# Altium schematic sheet AVR Board 4.0 FTDI Ports.SchDoc
size A
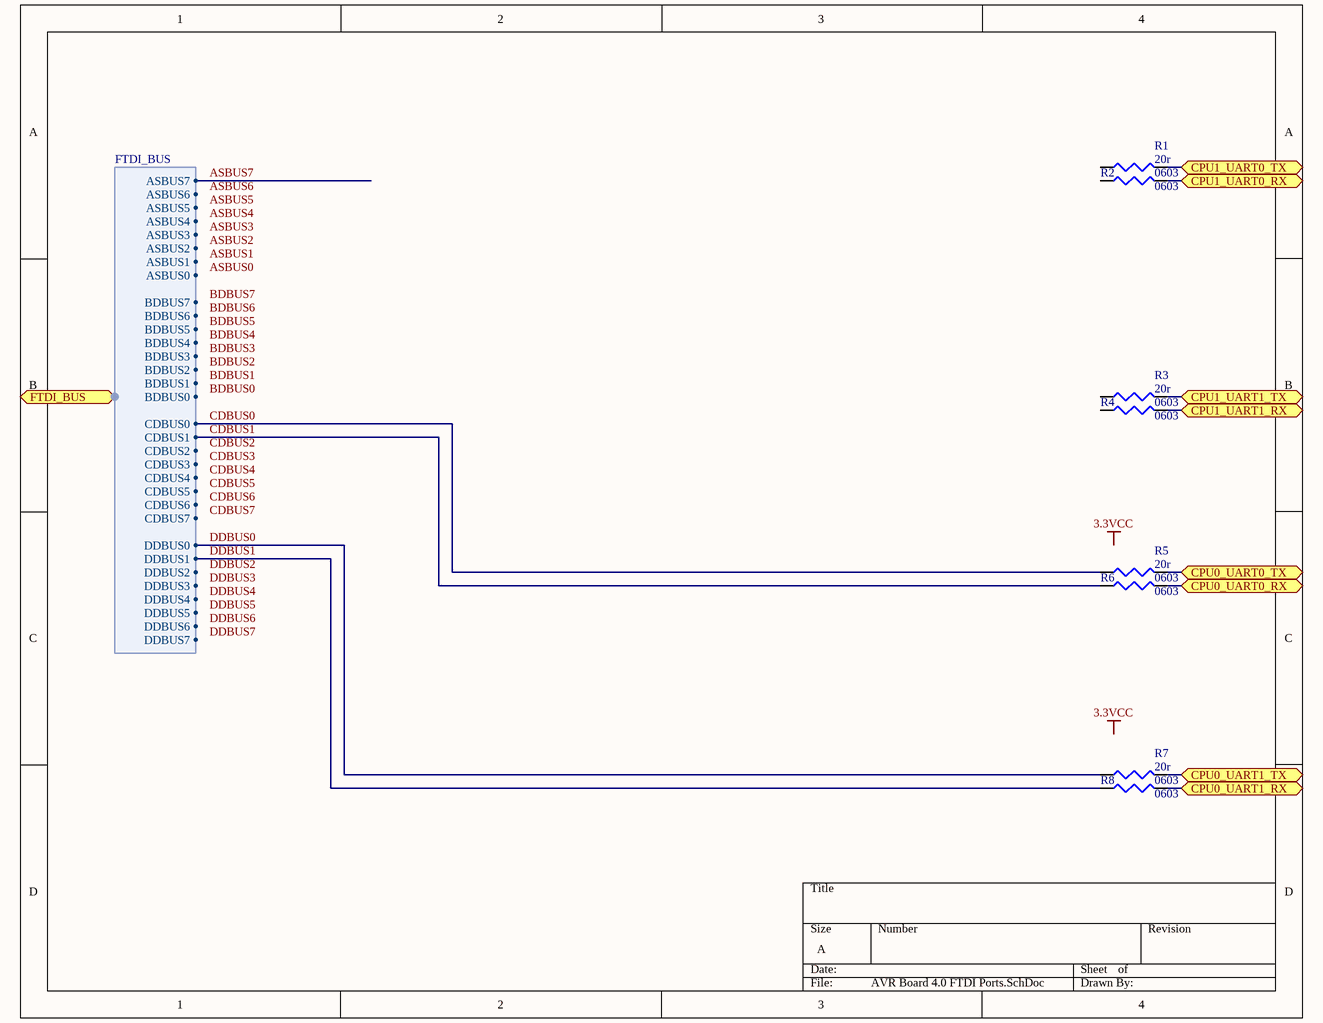
[diagram p0: AVR Board 4.0 FTDI Ports.SchDoc]

## Parts
R1  0603  value 20r  [J1-0603]
R2  0603  [J1-0603]
R3  0603  value 20r  [J1-0603]
R4  0603  [J1-0603]
R5  0603  value 20r  [J1-0603]
R6  0603  [J1-0603]
R7  0603  value 20r  [J1-0603]
R8  0603  [J1-0603]

## Ports
CPU0_UART0_RX, CPU0_UART0_TX, CPU0_UART1_RX, CPU0_UART1_TX, CPU1_UART0_RX, CPU1_UART0_TX, CPU1_UART1_RX, CPU1_UART1_TX, FTDI_BUS (harness FTDI_BUS)

## Harnesses
FTDI_BUS: BDBUS0, BDBUS1, BDBUS2, BDBUS3, BDBUS4, BDBUS5, BDBUS6, BDBUS7, CDBUS0, CDBUS1, CDBUS2, CDBUS3, CDBUS4, CDBUS5, CDBUS6, CDBUS7, DDBUS0, DDBUS1, DDBUS2, DDBUS3, DDBUS4, DDBUS5, DDBUS6, DDBUS7, ASBUS0, ASBUS1, ASBUS2, ASBUS3, ASBUS4, ASBUS5, ASBUS6, ASBUS7

## Nets
ASBUS7: port FTDI_BUS.ASBUS7
CDBUS0: R5.1 ; port FTDI_BUS.CDBUS0
CDBUS1: R6.1 ; port FTDI_BUS.CDBUS1
CPU0_UART0_RX: R6.2 ; port CPU0_UART0_RX
CPU0_UART0_TX: R5.2 ; port CPU0_UART0_TX
CPU0_UART1_RX: R8.2 ; port CPU0_UART1_RX
CPU0_UART1_TX: R7.2 ; port CPU0_UART1_TX
CPU1_UART0_RX: R2.2 ; port CPU1_UART0_RX
CPU1_UART0_TX: R1.2 ; port CPU1_UART0_TX
CPU1_UART1_RX: R4.2 ; port CPU1_UART1_RX
CPU1_UART1_TX: R3.2 ; port CPU1_UART1_TX
DDBUS0: R7.1 ; port FTDI_BUS.DDBUS0
DDBUS1: R8.1 ; port FTDI_BUS.DDBUS1

Not connected (* = marked no-connect by the designer): R1 1; R2 1; R3 1; R4 1

## Notes on the sheet
- Labels drawn without touching a wire or pin: 3.3VCC, ASBUS0, ASBUS1, ASBUS2, ASBUS3, ASBUS4, ASBUS5, ASBUS6, BDBUS0, BDBUS1, BDBUS2, BDBUS3, BDBUS4, BDBUS5, BDBUS6, BDBUS7, CDBUS2, CDBUS3, CDBUS4, CDBUS5, CDBUS6, CDBUS7, DDBUS2, DDBUS3, DDBUS4, DDBUS5, DDBUS6, DDBUS7

## Library data of the parts
R1-R8 = Res3: Resistor; Published: 8-Jun-2000; LatestRevisionDate: 29-May-2009; LatestRevisionNote: IPC-7351 Footprint Added.; PackageReference: J1-0603; Publisher: Altium Limited; PackageDescription: Chip Resistor